# Altium schematic sheet Top.SchDoc
size 420 x 297 mm; Date: UNUSED; CompanyName: CMT; DrawnBy: UNUSED; Engineer: UNUSED; Organization: Curtin Motorsport Team; Address1: Rm 151 Building 206; Address2: Curtin University; Address3: Kent Street, Bentley; Address4: Western Australia; DocumentNumber: UNUSED; Revision: UNUSED; SheetNumber: 1; SheetTotal: 5; Year: UNUSED; SheetSize: A3; Time: UNUSED; ImagePath: UNUSED; Application_BuildNumber: UNUSED
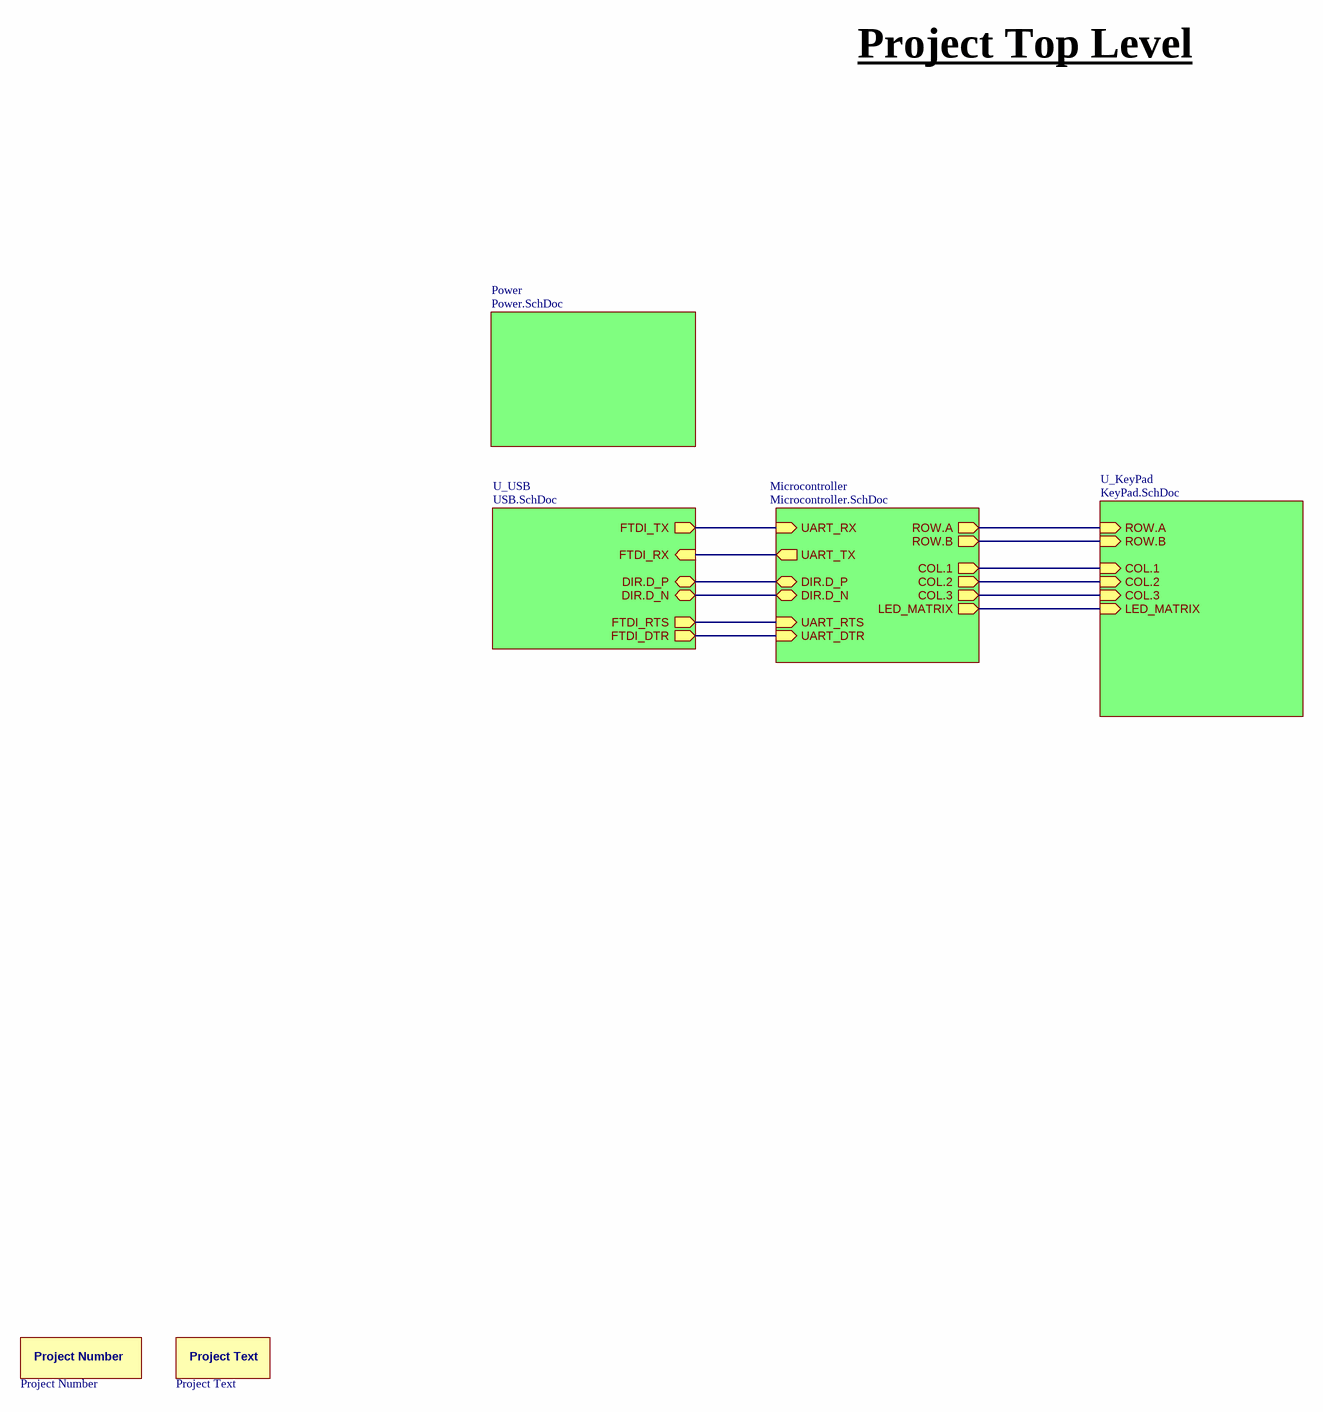
[diagram p0: Top.SchDoc]

## Parts
LOGO1  Project Number  [Project Number Overlay]  (no BOM)
LOGO2  Project Text  [Project Text-Footprint-1]  (no BOM)

## Sub-sheets
Microcontroller = Microcontroller.SchDoc: UART_RX (in), UART_TX (out), DIR.D_P (bidir), DIR.D_N (bidir), LED_MATRIX (out), COL.3 (out), COL.2 (out), COL.1 (out), ROW.B (out), ROW.A (out), UART_RTS (in), UART_DTR (in)
Power = Power.SchDoc: no entries
U_KeyPad = KeyPad.SchDoc: ROW.A (in), ROW.B (in), COL.1 (in), COL.2 (in), COL.3 (in), LED_MATRIX (in)
U_USB = USB.SchDoc: FTDI_TX (out), FTDI_RX (in), DIR.D_P (bidir), DIR.D_N (bidir), FTDI_RTS (out), FTDI_DTR (out)

## Nets
(unnamed): sheet Microcontroller/UART_RX, sheet U_USB/FTDI_TX
(unnamed): sheet Microcontroller/UART_TX, sheet U_USB/FTDI_RX
(unnamed): sheet Microcontroller/DIR.D_P, sheet U_USB/DIR.D_P
(unnamed): sheet Microcontroller/DIR.D_N, sheet U_USB/DIR.D_N
(unnamed): sheet Microcontroller/LED_MATRIX, sheet U_KeyPad/LED_MATRIX
(unnamed): sheet Microcontroller/COL.3, sheet U_KeyPad/COL.3
(unnamed): sheet Microcontroller/COL.2, sheet U_KeyPad/COL.2
(unnamed): sheet Microcontroller/COL.1, sheet U_KeyPad/COL.1
(unnamed): sheet Microcontroller/ROW.B, sheet U_KeyPad/ROW.B
(unnamed): sheet Microcontroller/ROW.A, sheet U_KeyPad/ROW.A
(unnamed): sheet Microcontroller/UART_RTS, sheet U_USB/FTDI_RTS
(unnamed): sheet Microcontroller/UART_DTR, sheet U_USB/FTDI_DTR

## Notes on the sheet
- Project Top Level
- Project:
- Title:
- Project Number:
- Size:
- Status:
- Revision:
- Year:
- Design Date:
- Author:
- Latest Revision Date:
- Sheet
- Checked:
- Checked
- of
- Date:

## Library data of the parts
LOGO1 = CMP-00004-5: Project Number Logo
LOGO2 = LOGO-00003-2